# EAGLE design iov-board-1.2 (EAGLE 9.6.2)
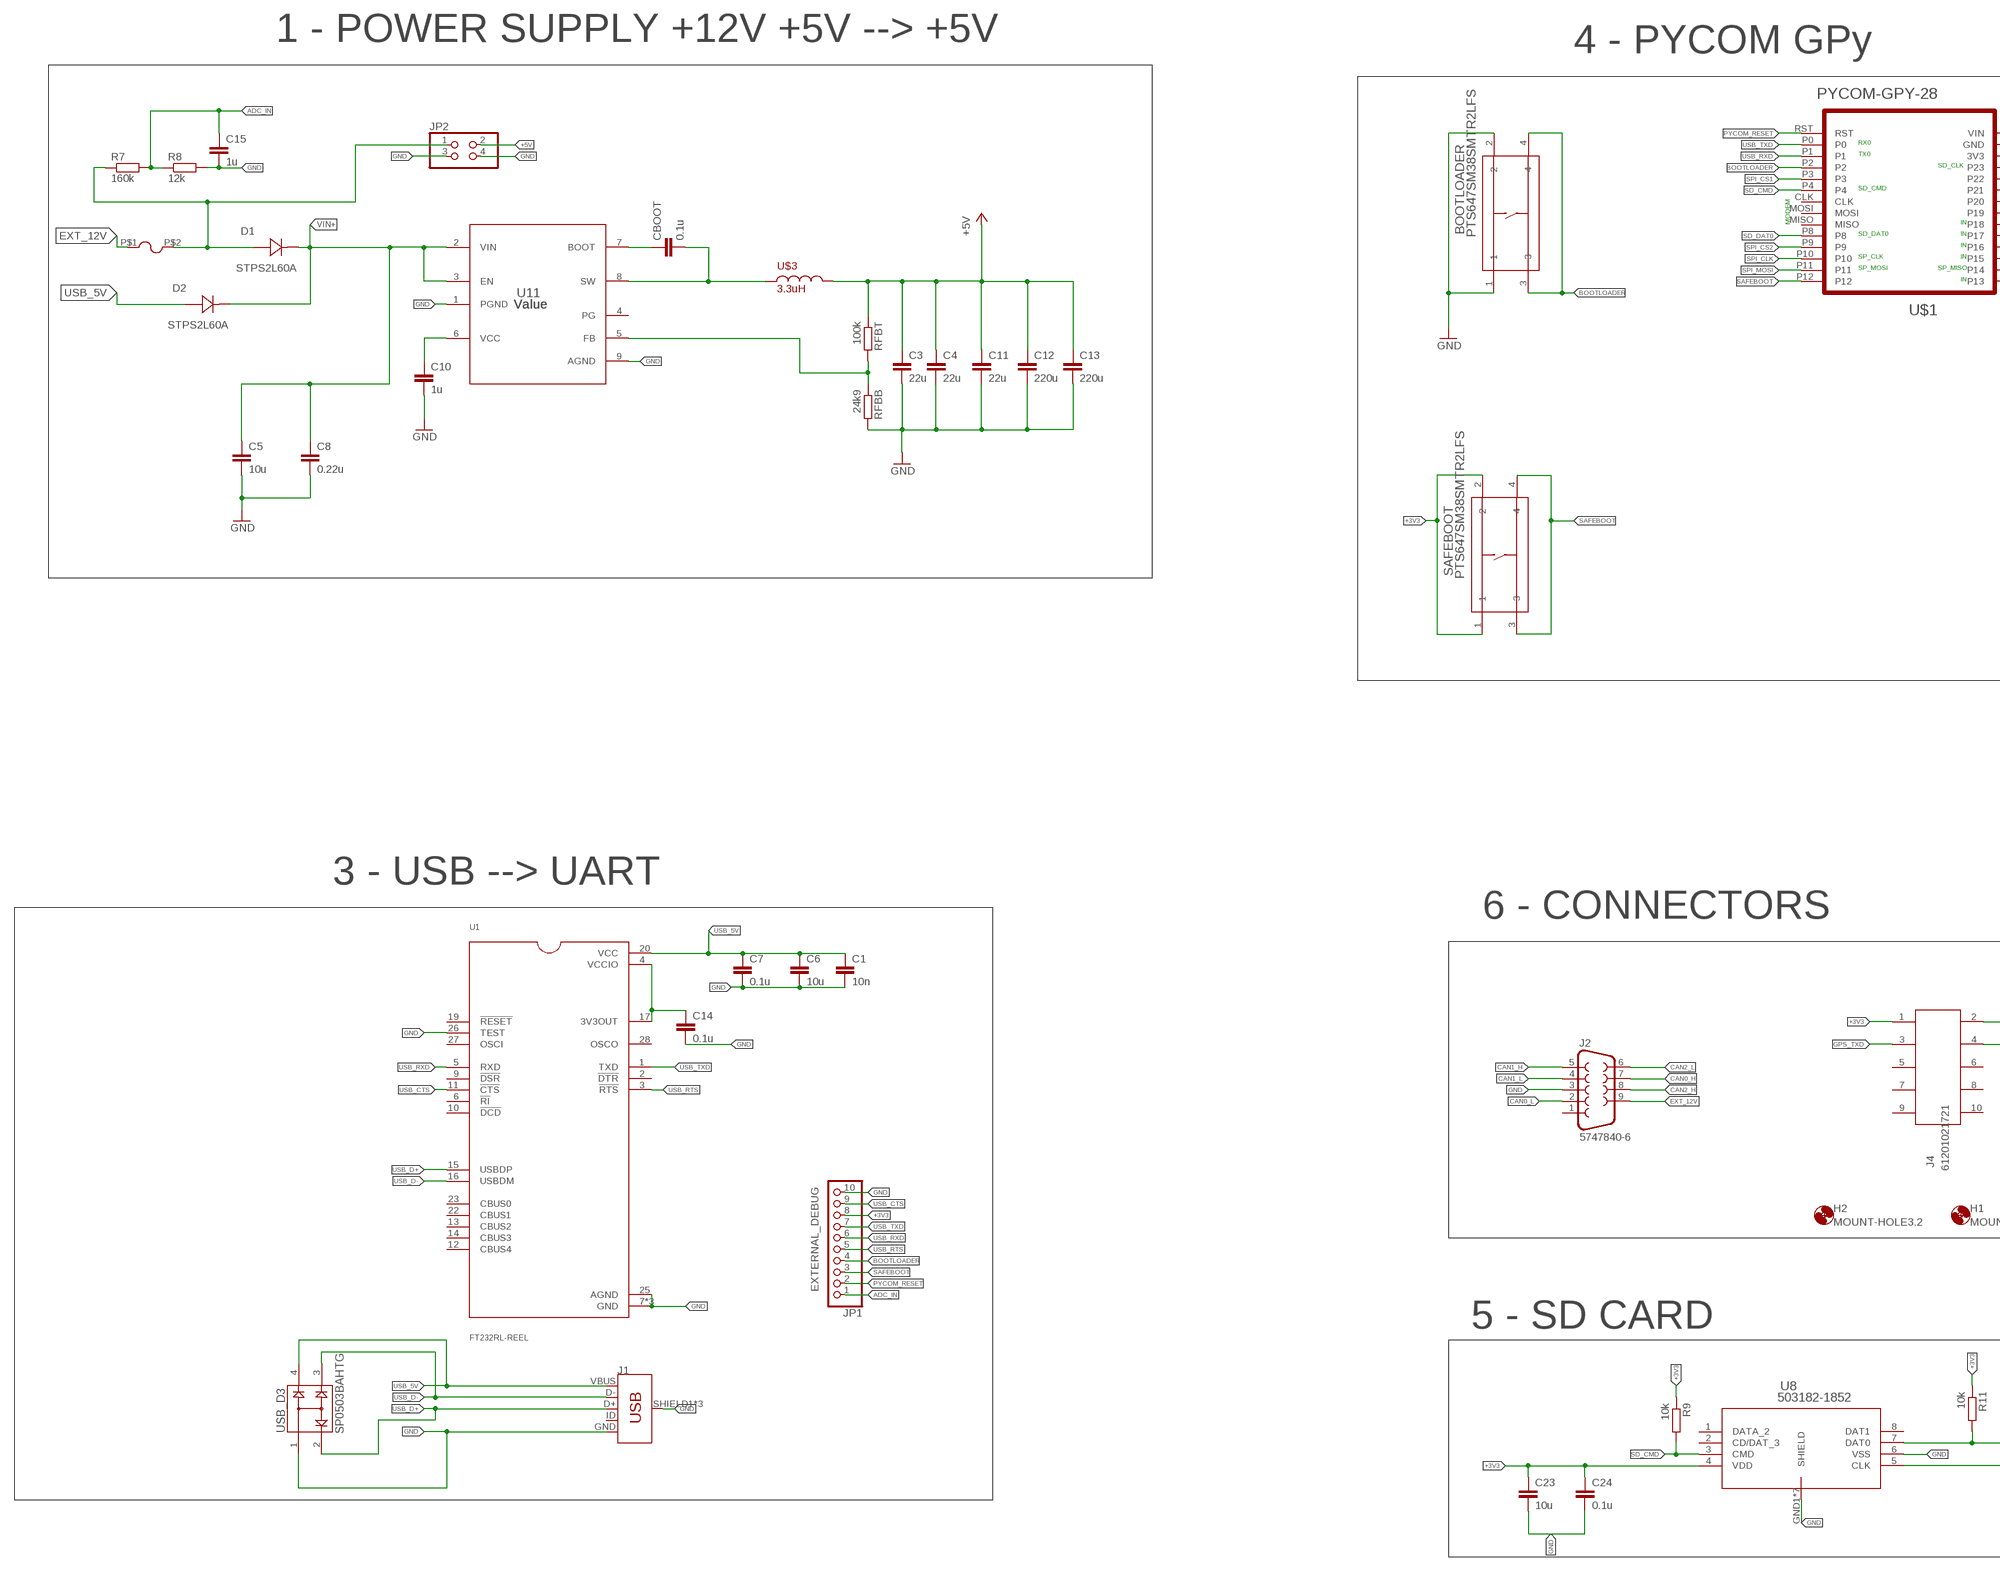
[diagram p0: schematic, sheet 1, part 1 of 2]
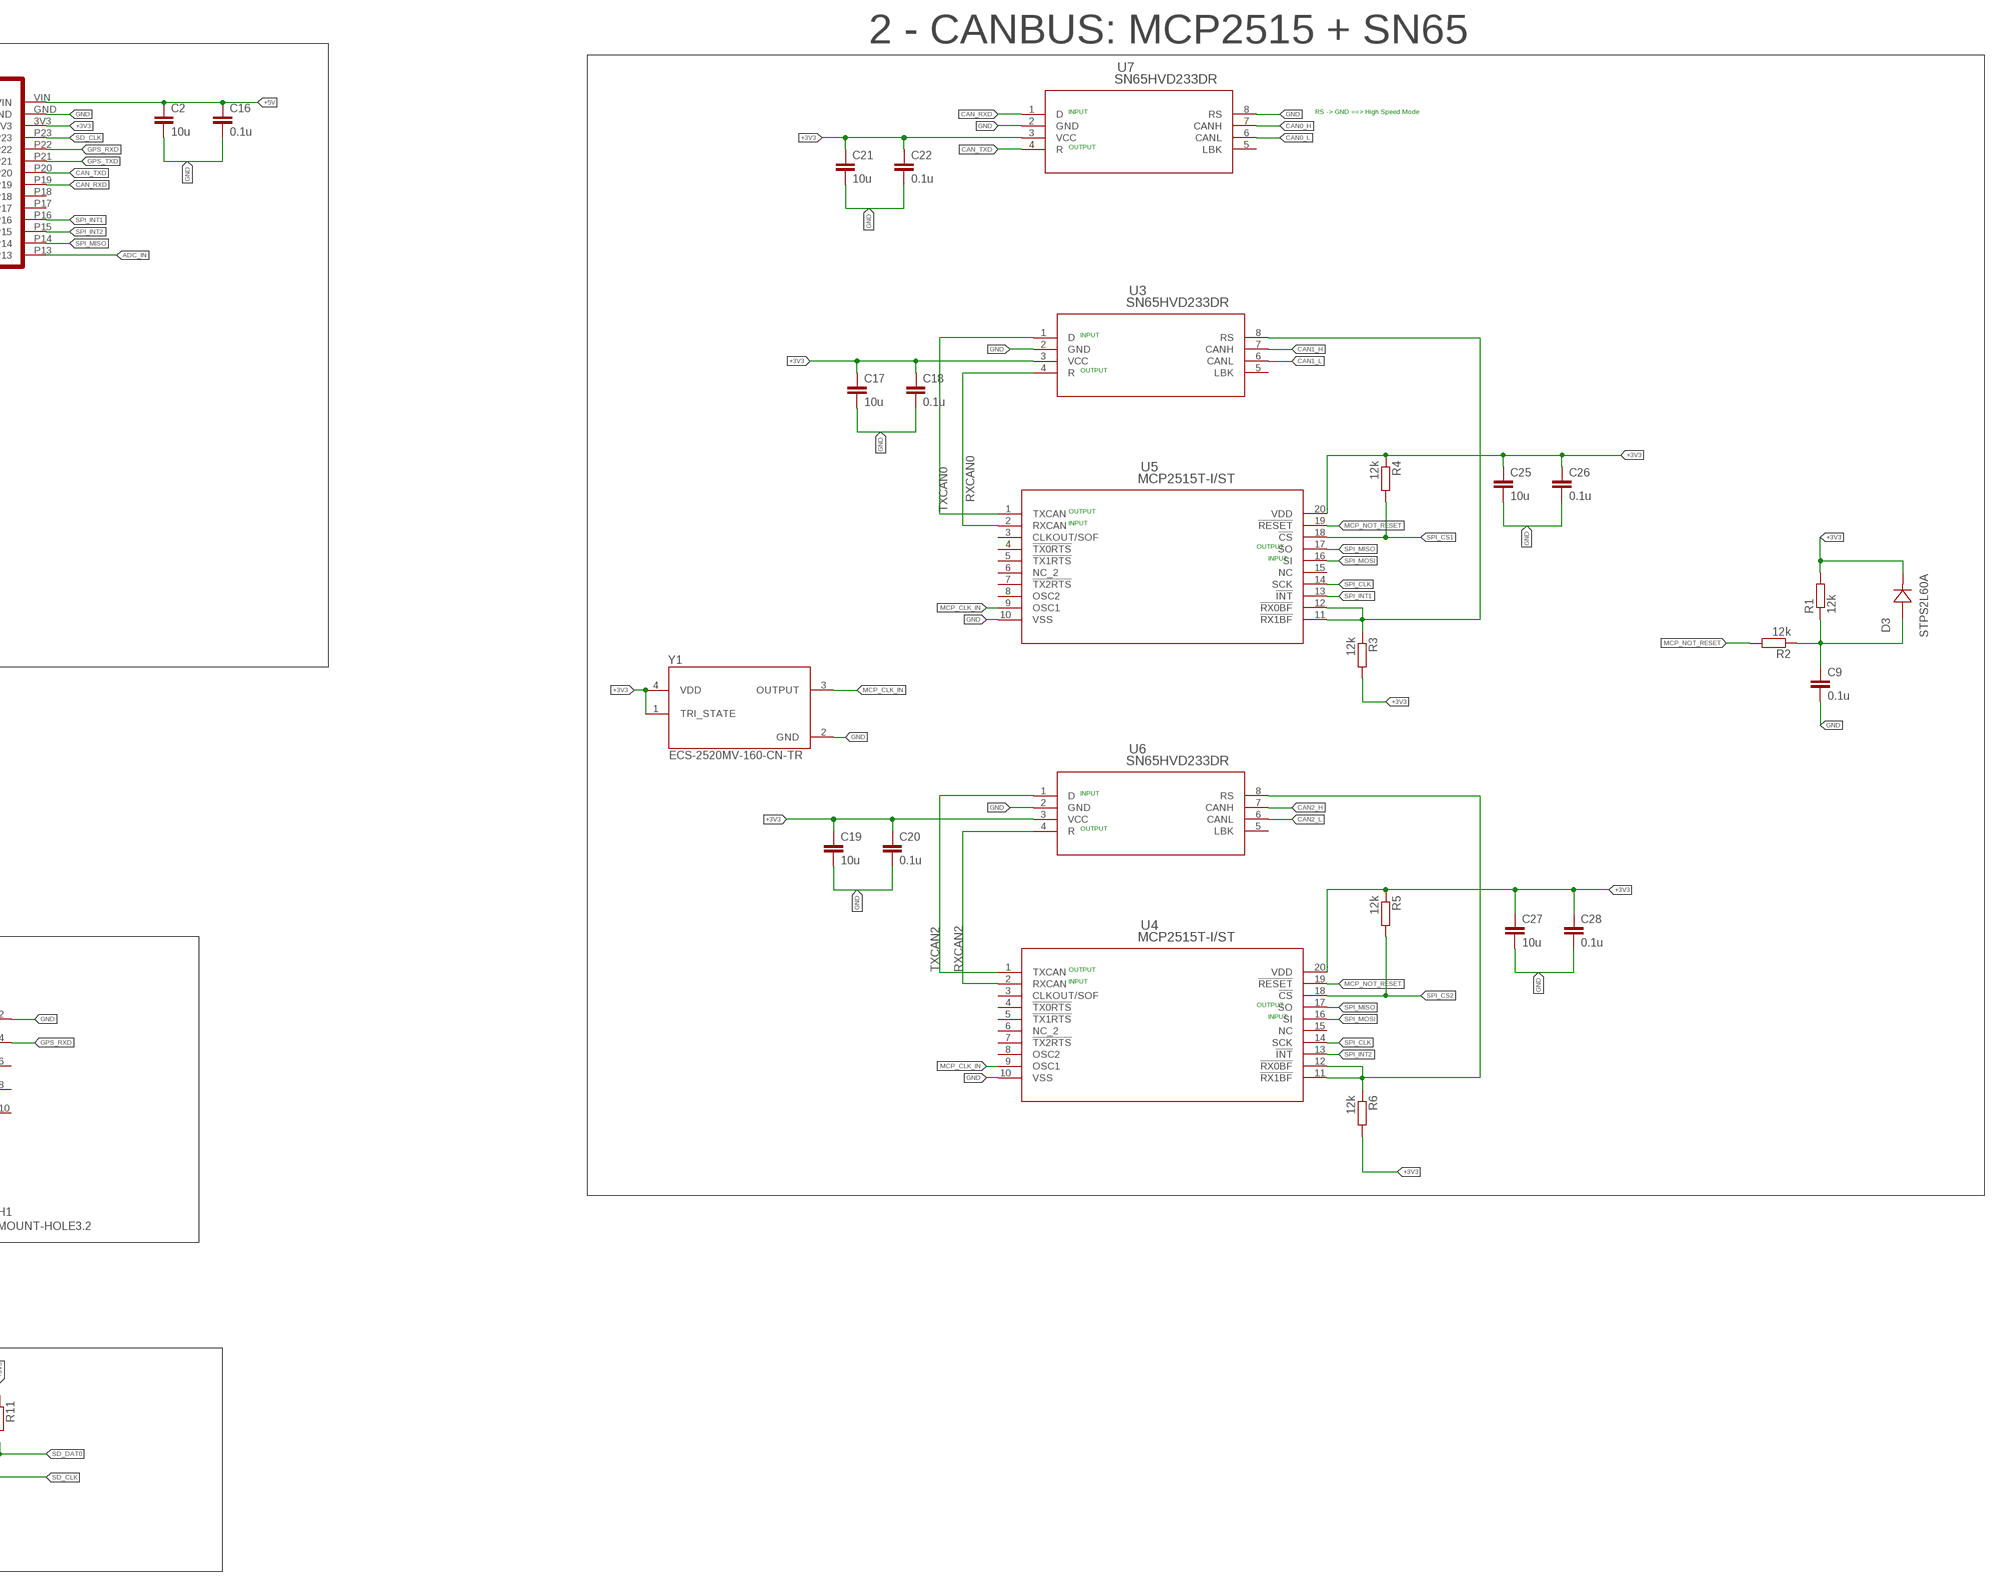
[diagram p1: schematic, sheet 1, part 2 of 2]

## Parts
BOOTLOADER  PTS647SM38SMTR2LFS  [SW_PTS647SM38SMTR2LFS_CNK]
C1  10n  C-EUC0805  [C0805]
C2  10u  C-EUC0805  [C0805]
C3  22u  C-EUC0805  [C0805]
C4  22u  C-EUC0805  [C0805]
C5  10u  C-EUC0805  [C0805]
C6  10u  C-EUC0805  [C0805]
C7  0.1u  C-EUC0805  [C0805]
C8  0.22u  C-EUC0805  [C0805]
C9  0.1u  C-EUC0805  [C0805]
C10  1u  C-EUC0805  [C0805]
C11  22u  C-EUC0805  [C0805]
C12  220u  C-EUC1210  [C1210]
C13  220u  C-EUC1210  [C1210]
C14  0.1u  C-EUC0805  [C0805]
C15  1u  C-EUC0805  [C0805]
C16  0.1u  C-EUC0805  [C0805]
C17  10u  C-EUC0805  [C0805]
C18  0.1u  C-EUC0805  [C0805]
C19  10u  C-EUC0805  [C0805]
C20  0.1u  C-EUC0805  [C0805]
C21  10u  C-EUC0805  [C0805]
C22  0.1u  C-EUC0805  [C0805]
C23  10u  C-EUC0805  [C0805]
C24  0.1u  C-EUC0805  [C0805]
C25  10u  C-EUC0805  [C0805]
C26  0.1u  C-EUC0805  [C0805]
C27  10u  C-EUC0805  [C0805]
C28  0.1u  C-EUC0805  [C0805]
CBOOT  0.1u  C-EUC0805  [C0805]
D1  STPS2L60A  [SMA_STM]
D2  STPS2L60A  [SMA_STM]
D3  STPS2L60A  [SMA_STM]
H1  MOUNT-HOLE3.2  [3,2]
H2  MOUNT-HOLE3.2  [3,2]
J1  USB_MICRO-B_FEMALE-SMT  [USB-B-MICRO-SMD]
J2  5747840-6  [TE_5747840-6]
J4  61201021721  [61201021721]
JP1  EXTERNAL_DEBUG  PINHD-1X10  [1X10]
JP2  PINHD-2X2  [2X02]
R1  12k  R-EU_R0805  [R0805]
R2  12k  R-EU_R0805  [R0805]
R3  12k  R-EU_R0805  [R0805]
R4  12k  R-EU_R0805  [R0805]
R5  12k  R-EU_R0805  [R0805]
R6  12k  R-EU_R0805  [R0805]
R7  160k  R-EU_R0805  [R0805]
R8  12k  R-EU_R0805  [R0805]
R9  10k  R-EU_R0805  [R0805]
R11  10k  R-EU_R0805  [R0805]
RFBB  24k9  R-EU_R0805  [R0805]
RFBT  100k  R-EU_R0805  [R0805]
SAFEBOOT  PTS647SM38SMTR2LFS  [SW_PTS647SM38SMTR2LFS_CNK]
U1  FT232RL-REEL  [SOP65P780X200-28N]
U3  SN65HVD233DR  [D8]
U4  MCP2515T-I/ST  [TSSOP20_MC_MCH]
U5  MCP2515T-I/ST  [TSSOP20_MC_MCH]
U6  SN65HVD233DR  [D8]
U7  SN65HVD233DR  [D8]
U8  503182-1852  [503182-1852_MOL]
U11  Value  LMR33640DDDAR  [DDA0008J]
U$1  PYCOM-GPY-28  [PYCOM_GPY-28]
U$3  3.3uH  3_3_UH  [3_3_UH]
U$4  LITTLEFUSE_658  [LITTLEFUSE_658]
USB_D3  SP0503BAHTG  [SOT143]
Y1  ECS-2520MV-160-CN-TR  [OSC_ECS-2520S25-250-FN-TR]

## Nets
+3V3: C17.1 C18.1 C19.1 C20.1 C21.1 C22.1 C23.1 C24.1 C25.1 C26.1 C27.1 C28.1 D3.1 J4.1 JP1.8 R1.2 R3.2 R4.1 R5.1 R6.2 R9.1 R11.1 SAFEBOOT.1 SAFEBOOT.2 U3.3(VCC) U4.20(VDD) U5.20(VDD) U6.3(VCC) U7.3(VCC) U8.4(VDD) U$1.3V3 Y1.1(TRI_STATE) Y1.4(VDD)
+5V: C2.1 C3.1 C4.1 C11.1 C12.1 C13.1 C16.1 JP2.2 RFBT.1 U$1.VIN U$3.P$2
ADC_IN: C15.1 JP1.1 R7.2 R8.1 U$1.P13
BOOTLOADER: BOOTLOADER.3 BOOTLOADER.4 JP1.4 U$1.P2
CAN0_H: J2.7 U7.7(CANH)
CAN0_L: J2.2 U7.6(CANL)
CAN1_H: J2.5 U3.7(CANH)
CAN1_L: J2.4 U3.6(CANL)
CAN2_H: J2.8 U6.7(CANH)
CAN2_L: J2.6 U6.6(CANL)
CAN_RXD: U7.1(D) U$1.P19
CAN_TXD: U7.4(R) U$1.P20
EXT_12V: J2.9 U$4.P$1
FB1: RFBB.1 RFBT.2 U11.5(FB)
GND: BOOTLOADER.1 BOOTLOADER.2 C1.2 C2.2 C3.2 C4.2 C5.2 C6.2 C7.2 C8.2 C9.2 C10.2 C11.2 C12.2 C13.2 C14.2 C15.2 C16.2 C17.2 C18.2 C19.2 C20.2 C21.2 C22.2 C23.2 C24.2 C25.2 C26.2 C27.2 C28.2 J1.GND J1.SHIELD1(SHIELD) J1.SHIELD2(SHIELD) J1.SHIELD3(SHIELD) J2.3 J4.2 JP1.10 JP2.3 JP2.4 R8.2 RFBB.2 U1.7(GND) U1.18(GND) U1.21(GND) U1.25(AGND) U1.26(TEST) U3.2(GND) U4.10(VSS) U5.10(VSS) U6.2(GND) U7.2(GND) U7.8(RS) U8.6(VSS) U8.GND1(SHIELD) U8.GND2(SHIELD) U8.GND3(SHIELD) U8.GND4(SHIELD) U8.GND5(SHIELD) U8.GND6(SHIELD) U8.GND7(SHIELD) U11.1(PGND) U11.9(AGND) U$1.GND USB_D3.1 Y1.2(GND)
GPS_RXD: J4.4 U$1.P22
GPS_TXD: J4.3 U$1.P21
MCP_CLK_IN: U4.9(OSC1) U5.9(OSC1) Y1.3(OUTPUT)
MCP_NOT_RESET: R2.2 U4.19(!RESET) U5.19(!RESET)
N$1: C10.1 U11.6(VCC)
N$2: C14.1 U1.4(VCCIO) U1.17(3V3OUT)
N$4: C9.1 D3.2 R1.1 R2.1
N$5: D1.2 JP2.1 R7.1 U$4.P$2
N$11: CBOOT.2 U11.8(SW) U$3.P$1
N$12: CBOOT.1 U11.7(BOOT)
N$25: R6.1 U4.11(!RX1BF) U4.12(!RX0BF) U6.8(RS)
N$45: R3.1 U3.8(RS) U5.11(!RX1BF) U5.12(!RX0BF)
PYCOM_RESET: JP1.2 U$1.RST
RXCAN0: U3.4(R) U5.2(RXCAN)
RXCAN2: U4.2(RXCAN) U6.4(R)
SAFEBOOT: JP1.3 SAFEBOOT.3 SAFEBOOT.4 U$1.P12
SD_CLK: U8.5(CLK) U$1.P23
SD_CMD: R9.2 U8.3(CMD) U$1.P4
SD_DAT0: R11.2 U8.7(DAT0) U$1.P8
SPI_CLK: U4.14(SCK) U5.14(SCK) U$1.P10
SPI_CS1: R4.2 U5.18(!CS) U$1.P3
SPI_CS2: R5.2 U4.18(!CS) U$1.P9
SPI_INT1: U5.13(!INT) U$1.P16
SPI_INT2: U4.13(!INT) U$1.P15
SPI_MISO: U4.17(SO) U5.17(SO) U$1.P14
SPI_MOSI: U4.16(SI) U5.16(SI) U$1.P11
TXCAN0: U3.1(D) U5.1(TXCAN)
TXCAN2: U4.1(TXCAN) U6.1(D)
USB_5V: C1.1 C6.1 C7.1 D2.2 J1.VBUS U1.20(VCC) USB_D3.4
USB_CTS: JP1.9 U1.11(!CTS)
USB_D+: J1.D+ U1.15(USBDP) USB_D3.2
USB_D-: J1.D- U1.16(USBDM) USB_D3.3
USB_RTS: JP1.5 U1.3(!RTS)
USB_RXD: JP1.6 U1.5(RXD) U$1.P1
USB_TXD: JP1.7 U1.1(TXD) U$1.P0
VIN+: C5.1 C8.1 D1.1 D2.1 U11.2(VIN) U11.3(EN)
Unconnected: J1.ID J2.1 J4.5 J4.6 J4.7 J4.8 J4.9 J4.10 U1.2(!DTR) U1.6(!RI) U1.9(!DSR) U1.10(!DCD) U1.12(CBUS4) U1.13(CBUS2) U1.14(CBUS3) U1.19(!RESET) U1.22(CBUS1) U1.23(CBUS0) U1.27(OSCI) U1.28(OSCO) U3.5(LBK) U4.3(CLKOUT/SOF) U4.4(!TX0RTS) U4.5(!TX1RTS) U4.6(NC_2) U4.7(!TX2RTS) U4.8(OSC2) U4.15(NC) U5.3(CLKOUT/SOF) U5.4(!TX0RTS) U5.5(!TX1RTS) U5.6(NC_2) U5.7(!TX2RTS) U5.8(OSC2) U5.15(NC) U6.5(LBK) U7.5(LBK) U8.1(DATA_2) U8.2(CD/DAT_3) U8.8(DAT1) U11.4(PG) U$1.CLK U$1.MISO U$1.MOSI U$1.P17 U$1.P18

## Notes on the sheet
- 1 - POWER SUPPLY +12V +5V --> +5V | 4 - PYCOM GPy
- 2 - CANBUS: MCP2515 + SN65
- RX0 | INPUT | RS -> GND ==> High Speed Mode
- TX0
- SD_CLK
- OUTPUT
- SD_CMD
- MODEM | IN
- SD_DAT0 | IN
- IN
- SP_CLK | IN
- SP_MOSI | SP_MISO
- IN
- INPUT
- OUTPUT
- OUTPUT
- INPUT
- OUTPUT
- INPUT
- INPUT
- OUTPUT
- 3 - USB --> UART
- 6 - CONNECTORS
- OUTPUT
- INPUT
- OUTPUT
- INPUT
- 5 - SD CARD

## Library data of the parts
BOOTLOADER SAFEBOOT = pushbutton:PTS647SM38SMTR2LFS; BUILT_BY: EMA_Kyle; COPYRIGHT: Copyright (C) 2018 Accelerated Designs. All rights reserved; MANUFACTURER_PART_NUMBER: PTS647SM38SMTR2LFS; SOURCELIBRARY: C&K_2020-02-14; VENDOR: C&K
C1-C28 CBOOT = rcl:C-EU: CAPACITOR, European symbol; SPICEPREFIX: C
D1-D3 = ‎STPS2L60A‎:STPS2L60A; BUILT_BY: EMA_UL_Team; MANUFACTURER_PART_NUMBER: STPS2L60A; SOURCELIBRARY: StMicro_2011-06-07; VENDOR: STMicroelectronics
H1 H2 = holes:MOUNT-HOLE: MOUNTING HOLE with drill center marker
J1 = SparkFun-Connectors_usb:USB_MICRO-B: USB Type Micro-B Connector Male/female and PTH/SMT variants SparkFun Products: SparkFun microB USB Breakout <https://www.sparkfun.com/products/12035> SparkFun USB microB Plug Breakout <https://www.sparkfun.com/products/10031> SparkFun ESP8266 Thing <https://www.sparkfun.com/products/13231>; PROD_ID: CONN-11752
J2 = 5747840-6:5747840-6: CONN D-SUB PLUG 9POS R/A SOLDER; CENTERLINE_PITCH: 2.74 mm[.108 in]; COMMENT: 5747840-6; NUMBER_OF_POSITIONS: 9; PRODUCT_TYPE: Connector
J4 = UEXT_61201021721:61201021721: WR-BHD 2.54mm Male Angled Box Header, 10 Pins=>Code : Con_WTB_BHD_2.54_Male_THT_WS_61201021721 <http://katalog.we-online.de/media/thumbs2/eican/thb_Con_WTB_BHD_2.54_Male_THT_WS_6120xx21721_pf2.jpg> Details see: http://katalog.we-online.de/en/em/612_0xx_217_21 Created 2014-06-05, Karrer Zheng 2014 (C) Würth Elektronik Check prices <https://pricing.snapeda.com/parts/61201021721/Wurth%20Electronics/view-part?ref=eda>; AVAILABILITY: Warning; DESCRIPTION: Connector Header Through Hole, Right Angle 10 position 0.100 (2.54mm); MF: Wurth Electronics; MP: 61201021721; PACKAGE: None; PRICE: None; PURCHASE-URL: https://pricing.snapeda.com/search/part/61201021721/?ref=eda
JP1 = pinhead:PINHD-1X10: PIN HEADER
JP2 = pinhead:PINHD-2X2: PIN HEADER
R1-R9 R11 RFBB RFBT = rcl:R-EU_: RESISTOR, European symbol; SPICEPREFIX: R
U1 = FT232RL-REEL:FT232RL-REEL: USB to serial UART interface Check prices <https://pricing.snapeda.com/parts/FT232RL-REEL/FTDI%2C/view-part?ref=eda>; AVAILABILITY: Good; DESCRIPTION: USB Bridge, USB to UART USB 2.0 UART Interface 28-SSOP; MF: FTDI,; MP: FT232RL-REEL; PACKAGE: SSOP-28 FTDI; PRICE: None; PURCHASE-URL: https://pricing.snapeda.com/search/part/FT232RL-REEL/?ref=eda
U3 U6 U7 = SN65:SN65HVD233DR; DATASHEET_URL: http://www.ti.com/lit/gpn/SN65HVD233; DESCRIPTION: 3.3V CAN Transceiver with Standby Mode, Loop-back; FAMILY_NAME: CAN; GENERIC_PART_NUMBER: SN65HVD233; INDUSTRY_STD_PKG_TYPE: SOIC; MANUFACTURER: Texas Instruments; MANUFACTURER_PART_NUMBER: SN65HVD233DR; PACKAGE_DESIGNATOR: D; PIN_COUNT: 8; VENDOR: Texas Instruments
U4 U5 = MCP2515-chip:MCP2515T-I/ST; BUILT_BY: EMA_UL_Team; MANUFACTURER_PART_NUMBER: MCP2515T-I/ST; SOURCELIBRARY: Microchip_2014-06-20; VENDOR: Microchip
U8 = molex_sdcard:503182-1852; BUILT_BY: EMA_Cory; COPYRIGHT: Copyright (C) 2018 Accelerated Designs. All rights reserved; DATASHEET: https://www.digikey.com/products/en?keywords=503182-1852; MANUFACTURER_PART_NUMBER: 503182-1852; SOURCELIBRARY: Molex_2020-01-22; VENDOR: Molex Connector Corporation
U11 = LMR33640DDDAR:LMR33640DDDAR; MANUFACTURER: Texas Instruments; PARTNUMBER: LMR33640DDDA; REFDES: RefDes; TYPE: TYPE
U$1 = pycom_gpy:PYCOM-GPY-28
U$3 = 3_3uH_indusctor:3_3_UH
U$4 = LittleFuse:LITTLEFUSE_658
USB_D3 = SP0503BAHTG:SP0503BAHTG: TVS DIODE 5.5VWM 8.5VC SOT143 Check prices <https://pricing.snapeda.com/parts/SP0503BAHTG/Littelfuse%20Inc./view-part?ref=eda>; AVAILABILITY: Good; DESCRIPTION: 8.5V Clamp Ipp Tvs Diode Surface Mount SOT-143-4; MF: Littelfuse Inc.; MP: SP0503BAHTG; PACKAGE: SOT-143 Littelfuse; PRICE: None; PURCHASE-URL: https://pricing.snapeda.com/search/part/SP0503BAHTG/?ref=eda
Y1 = OSC_16MHZ:ECS-2520MV-160-CN-TR: miniature SMD HCMOS Tight Stability Crystal Oscillator; DESCRIPTION: 16MHz XO (Standard) HCMOS Oscillator 1.6V ~ 3.6V Enable/Disable 4-SMD, No Lead; DIGI-KEY_PART_NUMBER: XC3030CT-ND; MF: ECS Inc.; MP: ECS-2520MV-160-CN-TR; PACKAGE: SMD-4 ECS International; PURCHASE-URL: https://pricing.snapeda.com/search/part/ECS-2520MV-160-CN-TR/?ref=eda

## Board
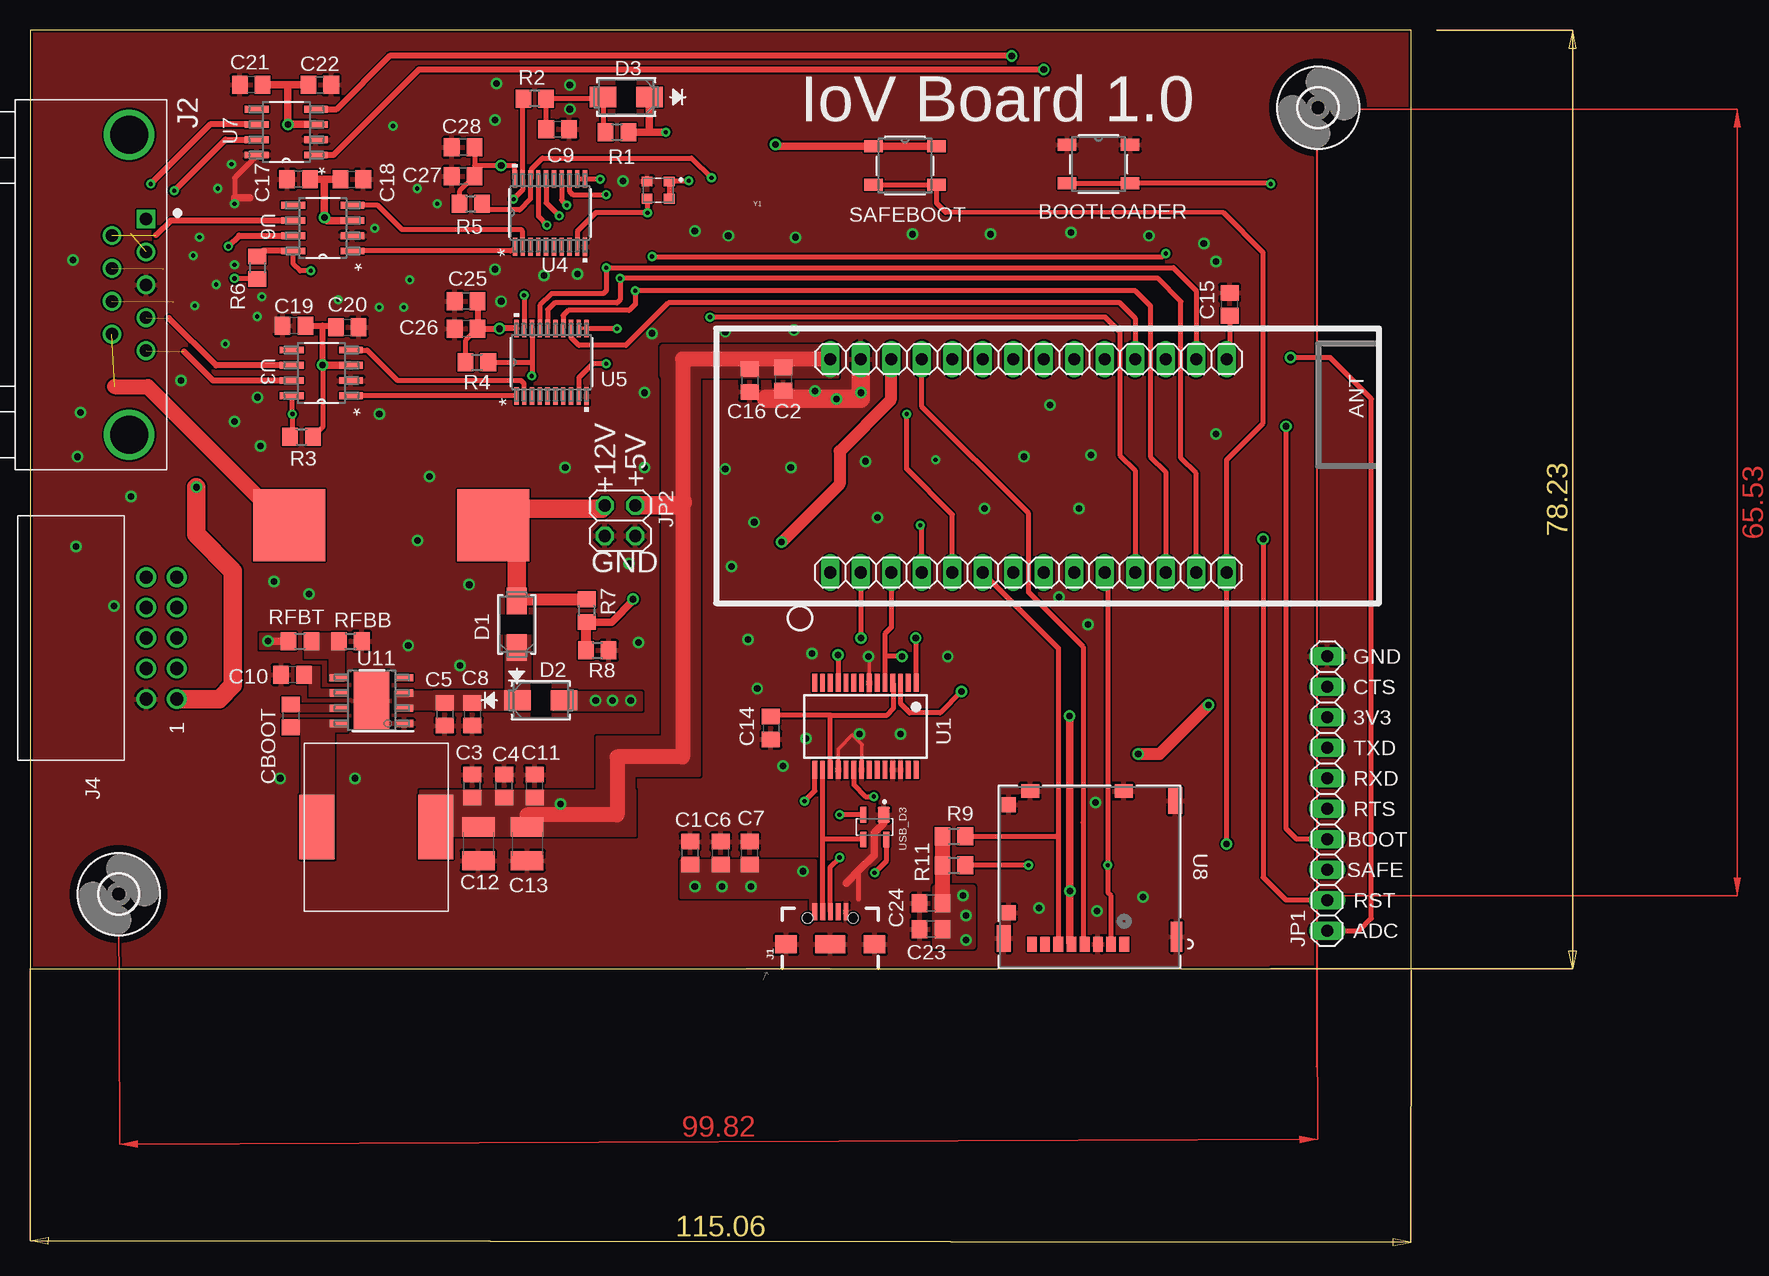
[diagram p2: board, top side]
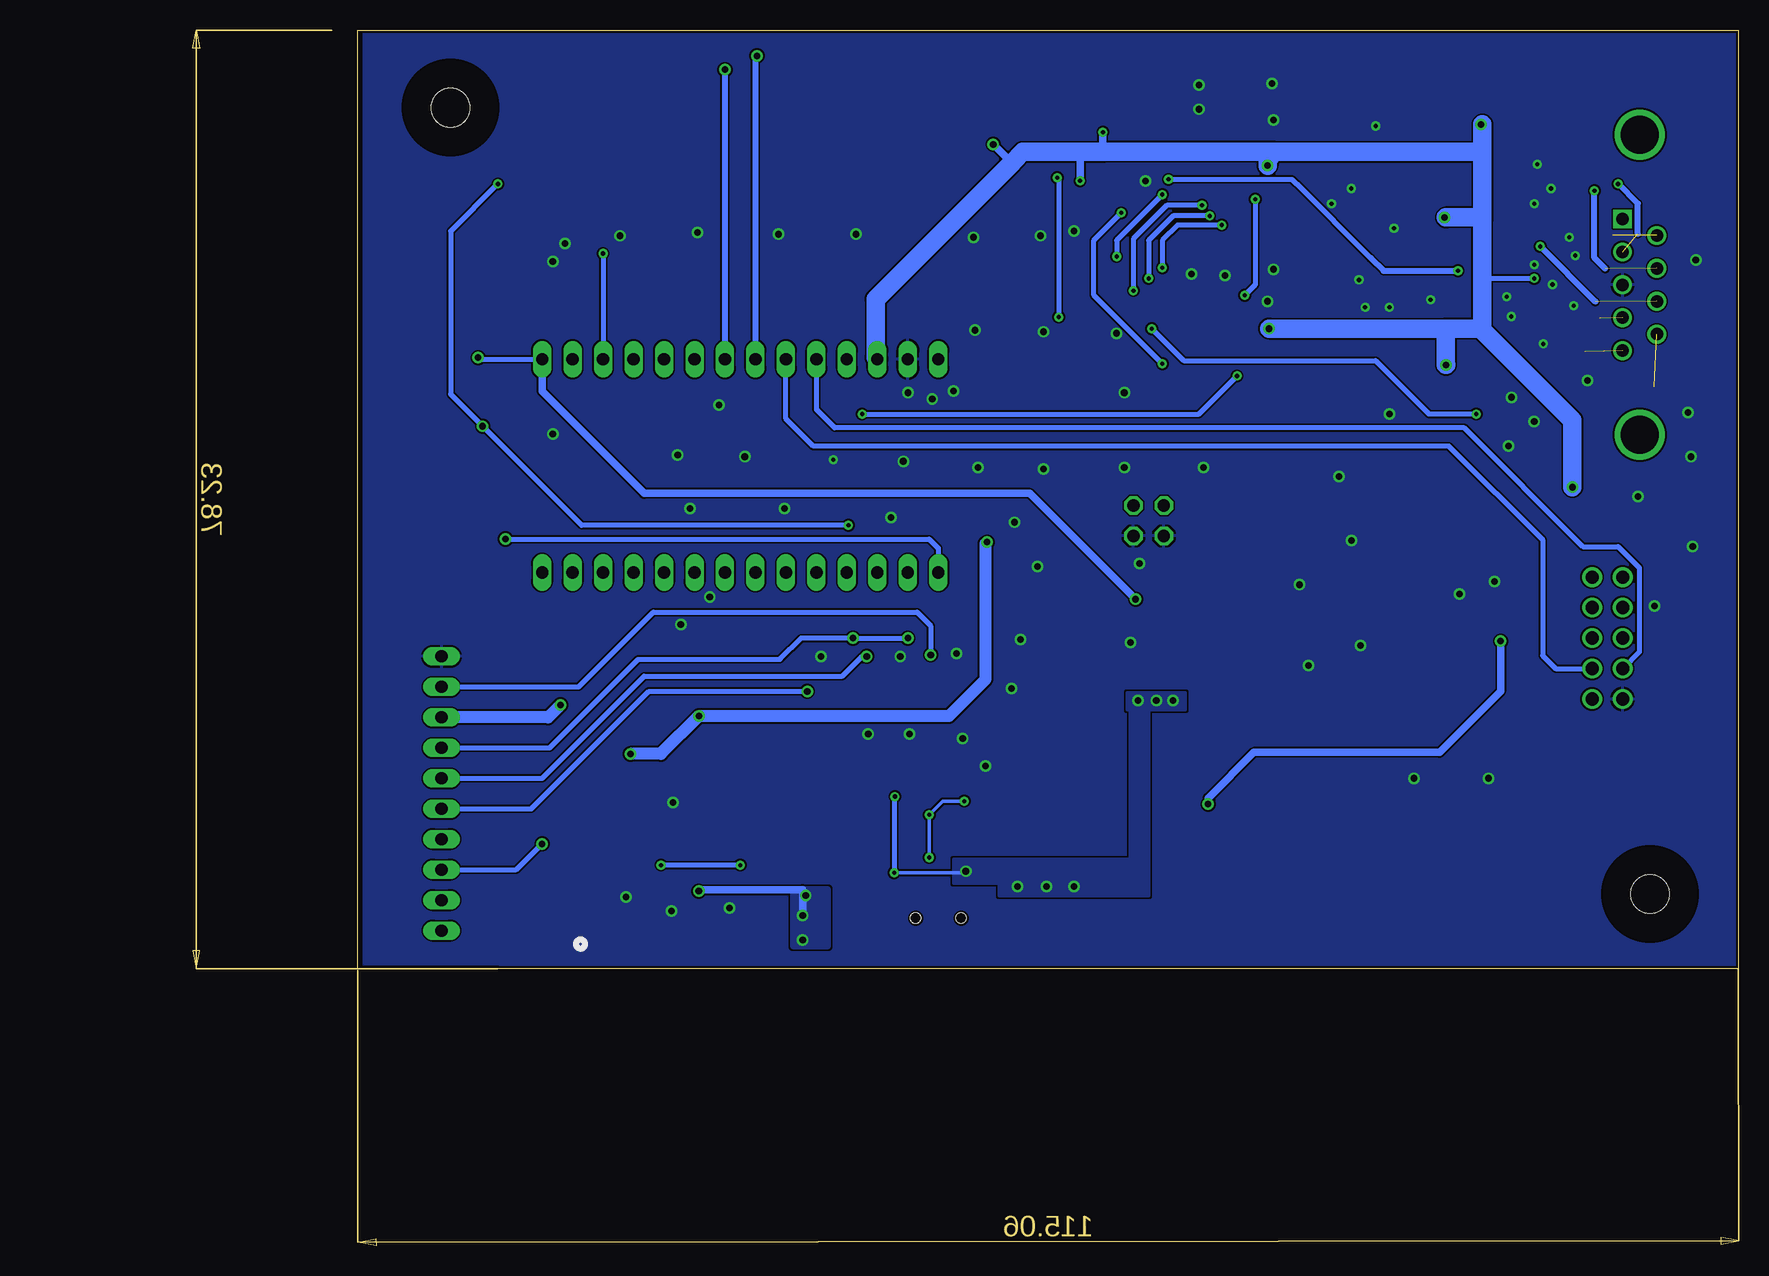
[diagram p3: board, bottom side, seen from below]

Size 115.06 x 78.23 mm. Coordinates in mm from the lower left corner, seen from the top.
Outline: 0,0 115.06,0 115.06,78.23 0,78.23 0,0
Copper layers (1*16): Top 0.035mm / dielectric 1.5mm / Bottom 0.035mm
Design rules "SyncTronic_v3_designRules": minimum track width 0.175mm, minimum drill 0.25mm, track to track 0.15mm, track to pad 0.15mm, pad to pad 0.15mm, via to via 0.15mm, smd to smd 0.15mm, copper to edge 0.2mm, drill to drill 6mil, minimum pad ring 10mil, minimum via ring 8mil, stop-mask expansion 4mil, vias tented up to drill 0.35mm, thermal gap 0.2mm

### Footprints (pad centres in the part's own frame; a part is rotated, then mirrored left to right if it is on the bottom)
SW_PTS647SM38SMTR2LFS_CNK = smd 1.549 x 0.991: 1 -2.625,1.6; 2 2.625,1.6; 3 -2.625,-1.6; 4 2.625,-1.6
C0805 = smd 1.3 x 1.5: 1 -0.95,0; 2 0.95,0
C1210 = smd 1.6 x 2.7: 1 -1.4,0; 2 1.4,0
SMA_STM = smd 2.21 x 1.702: 1 -1.93,0; 2 1.93,0
3,2 = hole 3.2: 0,0
USB-B-MICRO-SMD = smd 1.45 x 0.4: D+ 2.725,0; D- 2.725,0.65; GND 2.725,-1.3; ID 2.725,-0.65; VBUS 2.725,1.3 | smd 1.5 x 1.8: SHIELD1 0,3.685; SHIELD2 0,-3.685 | smd 1.5 x 2.5: SHIELD3 0,0 | hole 0.85: 2.2,1.9; 2.2,-1.9
TE_5747840-6 = drill 1.041 square: 1 0,0 | drill 1.041: 2 2.743,0; 3 5.486,0; 4 8.23,0; 5 10.973,0; 6 1.372,-2.845; 7 4.115,-2.845; 8 6.858,-2.845; 9 9.601,-2.845 | drill 3.175: G1 -7.01,-1.422; G2 17.983,-1.422
61201021721 = drill 1.1: 1 5.08,1.27; 2 5.08,-1.27; 3 2.54,1.27; 4 2.54,-1.27; 5 0,1.27; 6 0,-1.27; 7 -2.54,1.27; 8 -2.54,-1.27; 9 -5.08,1.27; 10 -5.08,-1.27
1X10 = drill 1.016 long: 1 -11.43,0; 2 -8.89,0; 3 -6.35,0; 4 -3.81,0; 5 -1.27,0; 6 1.27,0; 7 3.81,0; 8 6.35,0; 9 8.89,0; 10 11.43,0
2X02 = drill 1.016 octagon: 1 -1.27,-1.27; 2 -1.27,1.27; 3 1.27,-1.27; 4 1.27,1.27
R0805 = smd 1.3 x 1.5: 1 -0.95,0; 2 0.95,0
SOP65P780X200-28N = smd 1.5 x 0.4: 1 -3.625,4.225; 2 -3.625,3.575; 3 -3.625,2.925; 4 -3.625,2.275; 5 -3.625,1.625; 6 -3.625,0.975; 7 -3.625,0.325; 8 -3.625,-0.325; 9 -3.625,-0.975; 10 -3.625,-1.625; 11 -3.625,-2.275; 12 -3.625,-2.925; 13 -3.625,-3.575; 14 -3.625,-4.225; 15 3.625,-4.225; 16 3.625,-3.575; 17 3.625,-2.925; 18 3.625,-2.275; 19 3.625,-1.625; 20 3.625,-0.975; 21 3.625,-0.325; 22 3.625,0.325; 23 3.625,0.975; 24 3.625,1.625; 25 3.625,2.275; 26 3.625,2.925; 27 3.625,3.575; 28 3.625,4.225
D8 = smd 1.981 x 0.559: 1 -2.464,1.905; 2 -2.464,0.635; 3 -2.464,-0.635; 4 -2.464,-1.905; 5 2.464,-1.905; 6 2.464,-0.635; 7 2.464,0.635; 8 2.464,1.905
TSSOP20_MC_MCH = smd 1.473 x 0.356: 1 -2.819,2.925; 2 -2.819,2.275; 3 -2.819,1.625; 4 -2.819,0.975; 5 -2.819,0.325; 6 -2.819,-0.325; 7 -2.819,-0.975; 8 -2.819,-1.625; 9 -2.819,-2.275; 10 -2.819,-2.925; 11 2.819,-2.925; 12 2.819,-2.275; 13 2.819,-1.625; 14 2.819,-0.975; 15 2.819,-0.325; 16 2.819,0.325; 17 2.819,0.975; 18 2.819,1.625; 19 2.819,2.275; 20 2.819,2.925
503182-1852_MOL = smd 0.813 x 1.245: 1 4.8,5.82; 2 3.7,5.82; 3 2.6,5.82; 4 1.5,5.82; 5 0.4,5.82; 6 -0.7,5.82; 7 -1.8,5.82; 8 -2.9,5.82 | smd 0.94 x 2.489: GND1 -7.245,5.19 | smd 1.143 x 2.21: GND2 -7.145,-6.14; GND7 7.145,5.34 | smd 1.499 x 1.143: GND3 -2.84,-6.935; GND4 4.94,-6.935 | smd 1.168 x 1.245: GND5 6.74,-5.81; GND6 6.74,3.19
DDA0008J = smd 1.55 x 0.6: 1 -2.7,1.905; 2 -2.7,0.635; 3 -2.7,-0.635; 4 -2.7,-1.905; 5 2.7,-1.905; 6 2.7,-0.635; 7 2.7,0.635; 8 2.7,1.905 | smd 2.95 x 4.9: 9 0,0 | smd 0.5 x 0.5: 10 -0.65,0.65; 11 0.65,0.65; 12 -0.65,-0.65; 13 0.65,-0.65; 14 -0.65,-1.95; 15 0.65,-1.95; 16 -0.65,1.95; 17 0.65,1.95
PYCOM_GPY-28 = drill 1.016 long: 3V3 -8.89,-12.7; CLK 8.89,-2.54; GND -8.89,-15.24; MISO 8.89,2.54; MOSI 8.89,0; P0 8.89,-15.24; P1 8.89,-12.7; P2 8.89,-10.16; P3 8.89,-7.62; P4 8.89,-5.08; P8 8.89,5.08; P9 8.89,7.62; P10 8.89,10.16; P11 8.89,12.7; P12 8.89,15.24; P13 -8.89,15.24; P14 -8.89,12.7; P15 -8.89,10.16; P16 -8.89,7.62; P17 -8.89,5.08; P18 -8.89,2.54; P19 -8.89,0; P20 -8.89,-2.54; P21 -8.89,-5.08; P22 -8.89,-7.62; P23 -8.89,-10.16; RST 8.89,-17.78; VIN -8.89,-17.78
3_3_UH = smd 5.4 x 2.9: P$1 0,4.95; P$2 0,-4.95
LITTLEFUSE_658 = smd 6 x 6: P$1 -8.5,0; P$2 8.5,0
SOT143 = smd 0.99 x 1.3: 1 -0.76,-1.025 | smd 0.59 x 1.3: 2 0.96,-1.025; 3 0.96,1.025; 4 -0.96,1.025
OSC_ECS-2520S25-250-FN-TR = smd 0.9 x 0.8: 1 -0.925,-0.725; 2 0.925,-0.725; 3 0.925,0.725; 4 -0.925,0.725

### Placement (x,y rotation side)
BOOTLOADER  89.03,67.06 0 top
C1  54.99,9.65 90 top
C2  62.74,49.15 270 top
C3  36.83,15.24 90 top
C4  39.5,15.24 90 top
C5  34.54,21.21 270 top
C6  57.53,9.65 90 top
C7  59.94,9.65 90 top
C8  36.83,21.21 270 top
C9  43.94,69.98 0 top
C10  21.84,24.51 180 top
C11  42.04,15.24 90 top
C12  37.34,10.41 270 top
C13  41.4,10.41 270 top
C14  61.72,20.07 270 top
C15  99.95,55.37 90 top
C16  59.94,49.02 270 top
C17  22.35,65.79 180 top
C18  26.8,65.79 0 top
C19  21.97,53.59 180 top
C20  26.42,53.47 0 top
C21  18.41,73.66 180 top
C22  24.13,73.66 0 top
C23  75.06,3.3 180 top
C24  75.06,5.46 180 top
C25  36.32,55.63 180 top
C26  36.32,53.34 180 top
C27  36.07,66.04 180 top
C28  36.07,68.45 180 top
CBOOT  21.72,21.08 270 top
D1  40.54,28.7 90 top
D2  42.55,22.38 0 top
D3  49.66,72.64 180 top
H1  107.31,71.75 0 top
H2  7.37,6.22 0 top
J1  66.67,2.03 90 top
J2  9.65,62.48 270 top
J4  10.92,27.56 270 top
JP1  108.08,14.61 90 top
JP2  49.15,37.34 270 top
R1  48.9,69.72 0 top
R2  42.04,72.52 180 top
R3  22.61,44.32 0 top
R4  37.21,50.55 0 top
R5  36.7,63.75 0 top
R6  18.92,58.42 270 top
R7  46.35,29.84 270 top
R8  47.24,26.54 0 top
R9  76.96,11.05 0 top
R11  76.96,8.64 0 top
RFBB  26.67,27.3 0 top
RFBT  22.48,27.3 0 top
SAFEBOOT  72.9,66.93 0 top
U1  69.6,20.19 270 top
U3  24.26,49.66 180 top
U4  43.31,62.99 90 top
U5  43.43,50.55 90 top
U6  24.38,61.72 180 top
U7  21.34,69.72 180 top
U8  88.27,7.87 180 top
U11  28.45,22.35 180 top
U$1  84.45,41.91 270 top
U$3  28.83,11.81 90 top
U$4  30.1,36.96 0 top
USB_D3  70.36,11.81 180 top
Y1  52.32,64.9 180 top

### Tracks (layer width: path | path; a pad name or v marks a point on that pad's centre or on a via)
+3V3  (via drill 0.35, 0.55)
  Top 0.406: v24.36,50.32 24.36,45.12 R3.2 | U4.20 40.38,66.92 40.39,66.93 39.26,66.93 | v39.24,66.93 37.02,66.93 | 37.02,66.93 C27.1 35.75,64.78 R5.1 | C28.1 37.02,66.93 | C26.1 36.26,52.33 R4.1 | v17.02,57.53 18.86,57.53 R6.2 | v54.86,65.66 54.83,65.62 Y1.1 Y1.4
  Top 0.508: 39.26,66.93 v39.24,66.93 | U5.20 39.14,53.37 v39.12,53.34 C26.1 C25.1 | C19.1 24.36,53.59 | v24.36,50.32 24.36,53.59 | 24.36,53.59 25.47,53.59 C20.1
  Top 0.61: v62.1,68.71 62.28,68.53 SAFEBOOT.1 SAFEBOOT.2 | U8.4 86.64,2.18 v86.64,6.48 86.64,20.93 86.61,20.95 v86.61,21.08 | U$1.3V3 71.7,50.74 | 21.46,73.66 v21.46,70.36 U7.3 | 21.46,73.66 C21.1 | C22.1 21.46,73.66 | 24.51,65.79 C17.1 | 24.51,65.79 C18.1 | U6.3 24.77,62.36 v24.51,62.61 24.51,65.79 | U3.3 24.38,50.29 v24.36,50.32 | v52.96,69.72 51.69,69.72 | 51.69,69.72 R1.2 | D3.1 51.59,69.83 51.69,69.72
  Top 1.016: 71.7,50.74 71.7,47.41 67.44,43.15 67.44,40.39 v62.61,35.56 | v92.33,17.91 94.11,17.91 v98.17,21.97
  Top 1.27: R9.1 R11.1 C24.1
  Top 1.524: v13.84,40.13 13.84,36.2 16.89,33.15 16.89,23.62 15.75,22.48 J4.1
  Bottom 0.406: 21.34,57.66 21.21,57.53 v17.02,57.53
  Bottom 0.61: v62.1,68.71 60.62,67.22 60.49,67.22 | 62.74,35.43 v62.61,35.56 | v86.64,6.48 86.51,6.6 77.98,6.6 v77.98,4.45 | v21.46,70.36 21.34,70.36 | 24.38,62.61 v24.51,62.61 | 54.86,68.07 v54.86,65.66 | 52.96,68.07 v52.96,69.72
  Bottom 1.016: 62.74,35.43 62.74,24.13 65.79,21.08 v86.61,21.08 89.79,17.91 v92.33,17.91 | v98.17,21.97 99.19,20.95 JP1.8
  Bottom 1.524: U$1.3V3 71.91,50.95 71.91,55.81 60.49,67.22 59.64,68.07 54.86,68.07 52.96,68.07 38.61,68.07 | 38.61,68.07 21.34,68.07 | 21.34,53.21 13.84,45.72 v13.84,40.13 | 21.34,70.36 21.34,68.07 | 21.34,68.07 21.34,62.48 | 21.34,53.21 21.34,57.66 21.34,62.48 | 21.34,62.48 21.46,62.61 24.38,62.61 | 38.61,68.07 39.24,67.44 v39.24,66.93 | 21.34,53.21 21.46,53.34 24.38,53.34 | v39.12,53.34 24.38,53.34 | 24.38,53.34 24.38,50.34 v24.36,50.32
  other vias: 77.72,6.1 77.98,2.41
  pour Top (no thermals): 78.49,6.73 78.49,1.91 75.44,1.91 75.44,6.73
  pour Bottom: 75.95,6.6 78.74,6.6 78.74,1.91 75.95,1.91
+5V  (via drill 0.55)
  Top 0.61: RFBT.1 v19.81,27.3
  Top 1.27: U$1.VIN 54.36,50.8 54.36,38.86 54.36,17.65 48.9,17.65 48.9,12.83 41.4,12.83 C13.1
  Top 1.524: JP2.2 54.1,38.61 54.36,38.86
  Bottom 0.61: v19.81,27.3 19.81,23.11 24.89,18.03 40.39,18.03 44.2,14.22 v44.2,13.72
  pour Top (no thermals): 32.51,14.86 50.42,14.86 50.42,11.05 32.51,11.05
  pour Top (no thermals): 22.1,26.67 19.18,26.67 19.18,27.94 22.1,27.94
  pour Top (no thermals): 47.24,11.18 47.24,19.3 52.7,19.3 52.7,51.31 55.75,51.31 55.75,16.13 50.29,16.13 50.29,11.18
  pour Top (no thermals): 67.18,49.4 52.7,49.4 52.7,51.82 67.18,51.82
ADC_IN  (via drill 0.55)
  Top 0.406: C15.1 99.95,51.05 U$1.P13 | JP1.1 110.74,3.17 111.76,4.19 111.76,47.5 108.33,50.93 v105.03,50.93
  Top 0.61: R7.2 48.45,28.89 50.29,30.73 v50.23,30.8
  Top 0.813: R8.1 46.29,28.89 R7.2
  Bottom 0.406: v105.03,50.93 104.9,50.8 U$1.P13
  Bottom 0.61: v50.23,30.8 59.05,39.62 91.19,39.62 99.69,48.13 U$1.P13
BOOTLOADER  (via drill 0.35, 0.55)
  Top 0.406: U$1.P2 74.3,36.83 v74.17,36.96 | v103.38,65.41 103.33,65.46 BOOTLOADER.4 BOOTLOADER.3 | JP1.4 105.54,10.79 104.65,11.68 v104.65,45.21
  Bottom 0.406: v74.17,36.96 96.39,36.96 v104.65,45.21 107.31,47.88 107.31,61.47 v103.38,65.41
CAN0_H  (via drill 0.35)  (1 unrouted)
  Top 0.508: v12,64.83 16.26,69.09 U7.7
  Bottom 0.508: v12,64.83 12,59.24 11.1,58.34
CAN0_L  (via drill 0.35)  (1 unrouted)
  Top 0.508: U7.6 14.99,70.36 v10.03,65.41
  Bottom 0.508: 8.38,61.24 8.38,63.75 v10.03,65.41
CAN1_H  (1 unrouted)
  Top 0.508: U3.7 15.24,49.02 12.83,51.44
CAN1_L  (1 unrouted)
  Top 0.508: U3.6 15.49,50.29 11.56,54.23
CAN2_H  (via drill 0.35)  (1 unrouted)
  Top 0.508: v16.51,60.2 17.4,61.09 U6.7
  Bottom 0.508: 11.91,55.6 v16.51,60.2
CAN2_L  (1 unrouted)
  Top 0.508: U6.6 11.68,62.36 10.46,61.14
CAN_RXD  (via drill 0.55)
  Top 0.508: U7.1 25.27,67.82 32.38,74.93 v84.45,74.93
  Bottom 0.508: v84.45,74.93 U$1.P19
CAN_TXD  (via drill 0.55)
  Top 0.508: U7.4 25.53,71.63 29.97,76.07 v81.79,76.07
  Bottom 0.508: v81.79,76.07 81.92,75.95 U$1.P20
EXT_12V  (1 unrouted)
  Top 0.305: U$4.P$1 21.6,39.14
  Top 1.27: 7.04,48.51 9.8,48.51 19.18,39.14 21.6,39.14
FB1
  pour Top (no thermals): 26.16,24 26.16,27.94 22.86,27.94 22.86,25.91 24.89,25.91 24.89,24
GND  (via drill 0.35, 0.55)
  Top 0.305: U1.21 69.27,18.6 69.34,18.67 68.52,19.49 67.32,18.3 U1.18 | U1.7 69.92,25.71 69.85,25.78 v69.85,26.04
  Top 0.406: 69.03,5.81 69.03,8.19 | U7.8 18.87,67.77 17.02,65.91 v17.02,63.75
  Top 0.61: USB_D3.1 71.12,12.15 70.31,11.34 70.31,9.48 69.03,8.19 67.97,7.14 | v17.02,63.75 17.02,64.26 18.29,64.26
  Top 1.524: U$1.GND 69.22,47.5 61.34,47.5
  other vias: 15.49,57.02 17.02,58.67 65.41,48.13 67.18,47.5 69.22,48.01 69.6,42.29 59.82,27.43 76.45,26.04 57.91,53.09 63.63,53.21 51.82,52.96 51.18,48.01 58.17,61.09 63.75,60.96 55.37,61.47 49.4,65.66 73.53,61.21 80.01,61.21 86.74,61.34 93.22,61.09 97.79,60.45 98.81,58.93 98.81,44.58 79.5,38.35 82.8,42.67 84.96,46.99 70.61,37.59 87.38,38.35 85.72,30.99 88.14,28.7 65.15,26.29 60.58,23.37 64.64,19.18 69.09,19.56 14.1,60.96 16.76,67.06 15.62,65.02 30.23,70.23 33.91,63.75 32.26,65.02 31.62,57.4 29.08,46.23 75.44,42.42 88.39,42.8 72.52,19.56 62.74,16.89 13.72,55.24 16.26,52.07 3.81,35.18 6.99,30.23 3.56,59.05 35.81,25.27 20.32,32.26 50.67,27.18 49.91,33.78 88.9,4.83 84.07,5.08 92.71,5.97 88.77,13.84 44.58,41.78 36.58,32 32.26,35.69 33.27,41.02 23.24,31.24 51.18,41.78 63.37,41.78 60.33,37.21 58.42,33.53 57.91,41.66 20.83,15.88 27.05,15.88 31.5,26.92 13.59,59.44 18.92,47.62 19.18,43.56 17.02,45.59 12.57,49.02 4.19,46.35 3.94,42.67 8.38,39.37 44.96,71.63 44.96,73.66 38.86,73.79 38.73,70.74 28.7,61.72 25.65,55.75 19.3,56.01 18.92,54.36 29.08,55.12 31.11,55.12 42.8,57.78 38.73,58.29 39.24,55.63 45.59,57.91
  pour Bottom (rank 5): 0.08,78.13 114.55,78.13 114.55,0.1 0.08,0.1
  pour Top (no thermals): 14.86,57.4 20.45,57.4 20.45,53.09 14.86,53.09
  pour Top (rank 5): 0.25,78.11 114.68,78.11 114.68,0.13 0.25,0.13
GPS_RXD
  Bottom 0.406: J4.4 8.26,26.42 8.26,33.4 10.03,35.18 12.95,35.18 22.86,45.09 75.31,45.09 76.83,46.61 U$1.P22
GPS_TXD
  Bottom 0.406: J4.3 15.24,25.02 16.32,26.1 16.32,35.76 24.13,43.56 77.09,43.56 79.38,45.85 U$1.P21
MCP_CLK_IN  (via drill 0.35)
  Top 0.406: U4.9 45.58,61.46 47.15,63.03 51.4,63.03 v51.44,62.99 51.44,64.14 Y1.3 | v48.01,50.42 46.86,50.42 45.71,49.27 U5.9
  Bottom 0.406: v48.01,50.42 53.72,56.13 53.72,60.71 v51.44,62.99
MCP_NOT_RESET  (via drill 0.35)
  Top 0.406: R2.2 41.03,72.46 U4.19 41.03,64.91 v40.26,64.14 | v41.15,56.13 41.15,53.38 U5.19
  Bottom 0.406: v40.26,64.14 40.26,57.02 v41.15,56.13
N$1
  pour Top (no thermals): 26.42,23.24 24.13,23.24 24.13,25.15 22.23,25.15 22.23,23.88 23.24,23.88 23.24,22.73 26.42,22.73
N$2
  Top 0.406: U1.4 71.9,23.79 71.9,21.66 71.39,21.14 66.67,21.14 | 66.67,21.14 61.85,21.14 C14.1 | 66.67,21.14 U1.17
N$3
  Top 0.152: 107.19,71.63 107.19,-8.13
N$4
  Top 0.406: C9.1 R2.1 47.6,72.52 D3.2 47.73,69.94 R1.1
N$5
  Top 1.016: D1.2 40.7,30.8 R7.1
  Top 1.524: D1.2 40.54,35.02 U$4.P$2 38.6,37.33 39.62,38.35 47.62,38.35 JP2.1
N$11
  pour Top (no thermals): 26.42,20.7 21.08,20.7 21.08,19.81 26.42,19.81
  pour Top (no thermals): 25.27,9.14 22.61,9.14 22.61,20.57 25.27,20.57
N$12
  pour Top (no thermals): 26.54,21.97 22.35,21.97 22.35,22.61 21.08,21.46 26.54,21.46
N$25  (via drill 0.35)
  Top 0.406: v47.5,65.79 46.26,65.79 U4.11 U4.12 | v23.37,58.17 22.48,58.17 21.92,58.73 U6.8
  Top 0.508: U6.8 19.37,59.82 R6.1
  Bottom 0.406: v47.5,65.79 37.21,65.79 36.83,65.41 36.81,65.41 30.64,59.23
  Bottom 0.508: 30.64,59.23 29.57,58.17 v23.37,58.17
N$45  (via drill 0.35)
  Top 0.305: U5.11 U5.12
  Top 0.406: v48.9,53.34 46.38,53.34 U5.11 | U3.8 21.79,46.28 v21.84,46.23 21.84,44.51 R3.1
  Bottom 0.406: v21.84,46.23 25.78,46.23 30.23,50.67 46.23,50.67 v48.9,53.34
PYCOM_RESET  (via drill 0.55)
  Top 0.406: JP1.2 104.65,5.71 102.74,7.62 v102.74,35.81
  Bottom 0.406: U$1.RST 66.67,35.05 67.44,35.81 v102.74,35.81
RXCAN0
  Top 0.406: U3.4 28.07,51.56 30.61,49.02 40.89,49.02 41.16,48.76 U5.2
RXCAN2
  Top 0.406: U4.2 41.03,61.46 40.89,61.59 30.99,61.59 28.96,63.63 U6.4
SAFEBOOT  (via drill 0.55)
  Top 0.406: SAFEBOOT.3 SAFEBOOT.4 75.52,63.8 76.29,63.03 77.47,63.03 99.44,62.99 102.74,59.69 102.74,45.47 99.69,42.42 U$1.P12 v99.69,10.41
  Bottom 0.406: JP1.3 101.85,8.26 v99.69,10.41
SD_CLK
  Top 0.406: U$1.P23 74.3,46.84 83.19,37.95 83.19,31.37 87.74,26.82 87.74,12.19 87.74,2.18 U8.5
SD_CMD
  Top 0.406: 85.67,11.18 85.67,26.73 U$1.P4 | 85.67,11.18 U8.3 | R9.2 85.54,11.05 85.67,11.18
SD_DAT0  (via drill 0.35)
  Top 0.406: U8.7 90.06,6.07 89.79,6.35 v89.79,8.64 89.79,32.77 U$1.P8 | v83.19,8.64 R11.2
  Bottom 0.406: v83.19,8.64 v89.79,8.64
SPI_CLK  (via drill 0.35)
  Top 0.406: U$1.P10 94.61,41.4 93.34,42.67 93.34,55.24 92.08,56.52 v50.42,56.52 50.42,55.37 49.91,54.86 44.83,54.86 44.41,54.44 U5.14 | U4.14 44.28,64.05 v44.7,63.63
  Bottom 0.406: v44.7,63.63 47.62,63.63 50.42,60.83 v50.42,56.52
SPI_CS1  (via drill 0.35)
  Top 0.406: U$1.P3 76.83,37.85 73.03,41.66 v73.03,46.23 | U5.18 41.81,50.55 | 41.81,50.55 41.81,49.43 v41.78,49.4 | R4.2 41.81,50.55
  Bottom 0.406: v73.03,46.23 44.96,46.23 v41.78,49.4
SPI_CS2  (via drill 0.35)
  Top 0.406: v56.64,54.31 89.58,54.31 90.81,53.09 90.81,42.8 92.08,41.53 U$1.P9 | v56.77,65.91 55.12,67.56 42.67,67.56 41.78,66.67 41.78,65.91 U4.18 41.68,64.16 40.77,63.25 38.16,63.25 R5.2
  Bottom 0.406: v56.77,65.91 56.64,65.79 v56.64,54.31
SPI_INT1
  Top 0.406: U$1.P16 92.08,54.23 90.81,55.5 53.18,55.5 49.62,51.94 45.72,51.94 45.06,52.6 U5.13
SPI_INT2  (via drill 0.35)
  Top 0.406: v94.61,59.61 94.36,59.35 v51.82,59.35 | U4.13 44.93,64.8 45.21,64.52 v48.01,64.52
  Bottom 0.406: v94.61,59.61 U$1.P15 | v48.01,64.52 51.82,60.71 v51.82,59.35
SPI_MISO  (via drill 0.35)
  Top 0.406: U$1.P14 97.16,56.52 95.25,58.42 v48.01,58.42 48.01,56.52 47.75,56.26 43.43,56.26 42.46,55.29 U5.17 | U4.17 42.33,62.7 v43.05,61.98
  Bottom 0.406: v43.05,61.98 46.74,61.98 48.01,60.71 v48.01,58.42
SPI_MOSI  (via drill 0.35)
  Top 0.406: U$1.P11 97.16,41.27 95.89,42.55 95.89,55.63 93.98,57.53 v49.15,57.53 49.15,55.75 48.9,55.5 43.69,55.5 43.11,54.92 U5.16 | U4.16 42.98,63.83 v44.07,62.74
  Bottom 0.406: v44.07,62.74 47.12,62.74 49.15,60.71 v49.15,57.53
TXCAN0
  Top 0.305: U5.1 40.48,47.75
  Top 0.406: 40.48,47.75 U3.1
TXCAN2
  Top 0.305: U4.1 40.03,59.82
  Top 0.406: 40.03,59.82 U6.1
USB_5V  (via drill 0.35, 0.55)
  Top 0.406: USB_D3.4 71.32,8.96 v70.36,8 | U1.20 68.62,15.33 69.6,14.35 v70.29,14.35
  Bottom 0.305: v70.36,8 64.52,8 v64.39,8.13
  Bottom 0.406: v70.29,14.35 70.36,14.29 v70.36,8
  other vias: 57.66,6.86 60.07,6.86 47.12,22.35 48.51,22.35 50.04,22.35 55.37,6.86
  pour Top (no thermals): 65.41,4.95 65.41,9.02 54.23,9.02 54.23,5.97 65.02,5.97 65.02,4.95
  pour Bottom: 65.41,9.14 65.41,7.11 61.21,7.11 61.21,9.14
  pour Top (no thermals): 43.56,22.99 50.93,22.99 50.93,21.59 43.56,21.59
  pour Bottom: 46.1,22.99 46.1,21.59 50.93,21.59 50.93,22.99
  pour Bottom: 49.15,22.99 49.15,6.1 61.59,6.1 61.59,9.14 50.67,9.14 50.67,22.99
USB_CTS  (via drill 0.55)
  Top 0.406: v67.31,26.16 U1.11
  Bottom 0.406: JP1.9 96.65,23.5 90.42,29.72 68.45,29.72 67.31,28.57 v67.31,26.16
USB_D+  (via drill 0.35)
  Top 0.305: v67.44,12.83 v67.45,12.84
  Top 0.406: J1.D+ 66.67,8.51 v67.44,9.27 | v64.52,13.97 65.37,14.82 U1.15 | USB_D3.2 v67.45,12.84
  Bottom 0.305: v67.44,9.27 v67.44,12.83 66.29,13.97 v64.52,13.97
USB_D-
  Top 0.305: 66.03,11.95 66.02,11.96 | USB_D3.3 69.39,10.79
  Top 0.406: J1.D- 66.03,10.79 | 66.03,10.79 66.03,11.95 | 66.02,11.96 U1.16 | 69.39,10.79 66.03,10.79
USB_RTS  (via drill 0.55)
  Top 0.406: v77.6,23.11 75.82,21.34 73.28,21.34 72.52,22.09 U1.3
  Bottom 0.406: JP1.5 100.58,13.34 90.81,23.11 83.31,23.11 83.06,23.11 v77.6,23.11
USB_RXD  (via drill 0.55)
  Top 0.406: U$1.P1 71.75,28.45 71.22,27.91 71.22,26.04 | 71.22,26.04 U1.5 | v72.64,26.04 71.22,26.04
  Bottom 0.406: JP1.6 99.69,15.88 91.19,24.38 74.68,24.38 73.03,26.04 v72.64,26.04
USB_TXD  (via drill 0.55)
  Top 0.406: U1.1 73.82,27.52 v73.79,27.56 | U$1.P0 v69.22,27.56
  Bottom 0.406: v69.22,27.56 v73.79,27.56 78.11,27.56 79.88,25.78 91.69,25.78 99.06,18.41 JP1.7
VIN+
  pour Top (no thermals): 41.66,27.94 41.66,22.1 39.62,22.1 39.62,27.94
  pour Top (no thermals): 37.47,21.59 30.35,21.59 30.35,23.11 37.47,23.11
  pour Top (no thermals): 33.66,23.11 33.66,21.59 41.66,21.59 41.66,23.11
(copper drawn outside any net)
  shapes: Top area x2

### Text on the board
tNames: IoV Board 1.0 | +12V | +5V | GND | GND | CTS | 3V3 | TXD | RXD | RTS | BOOT | SAFE | RST | ADC